# Altium schematic sheet 12_fit_YC.SchDoc
size A2
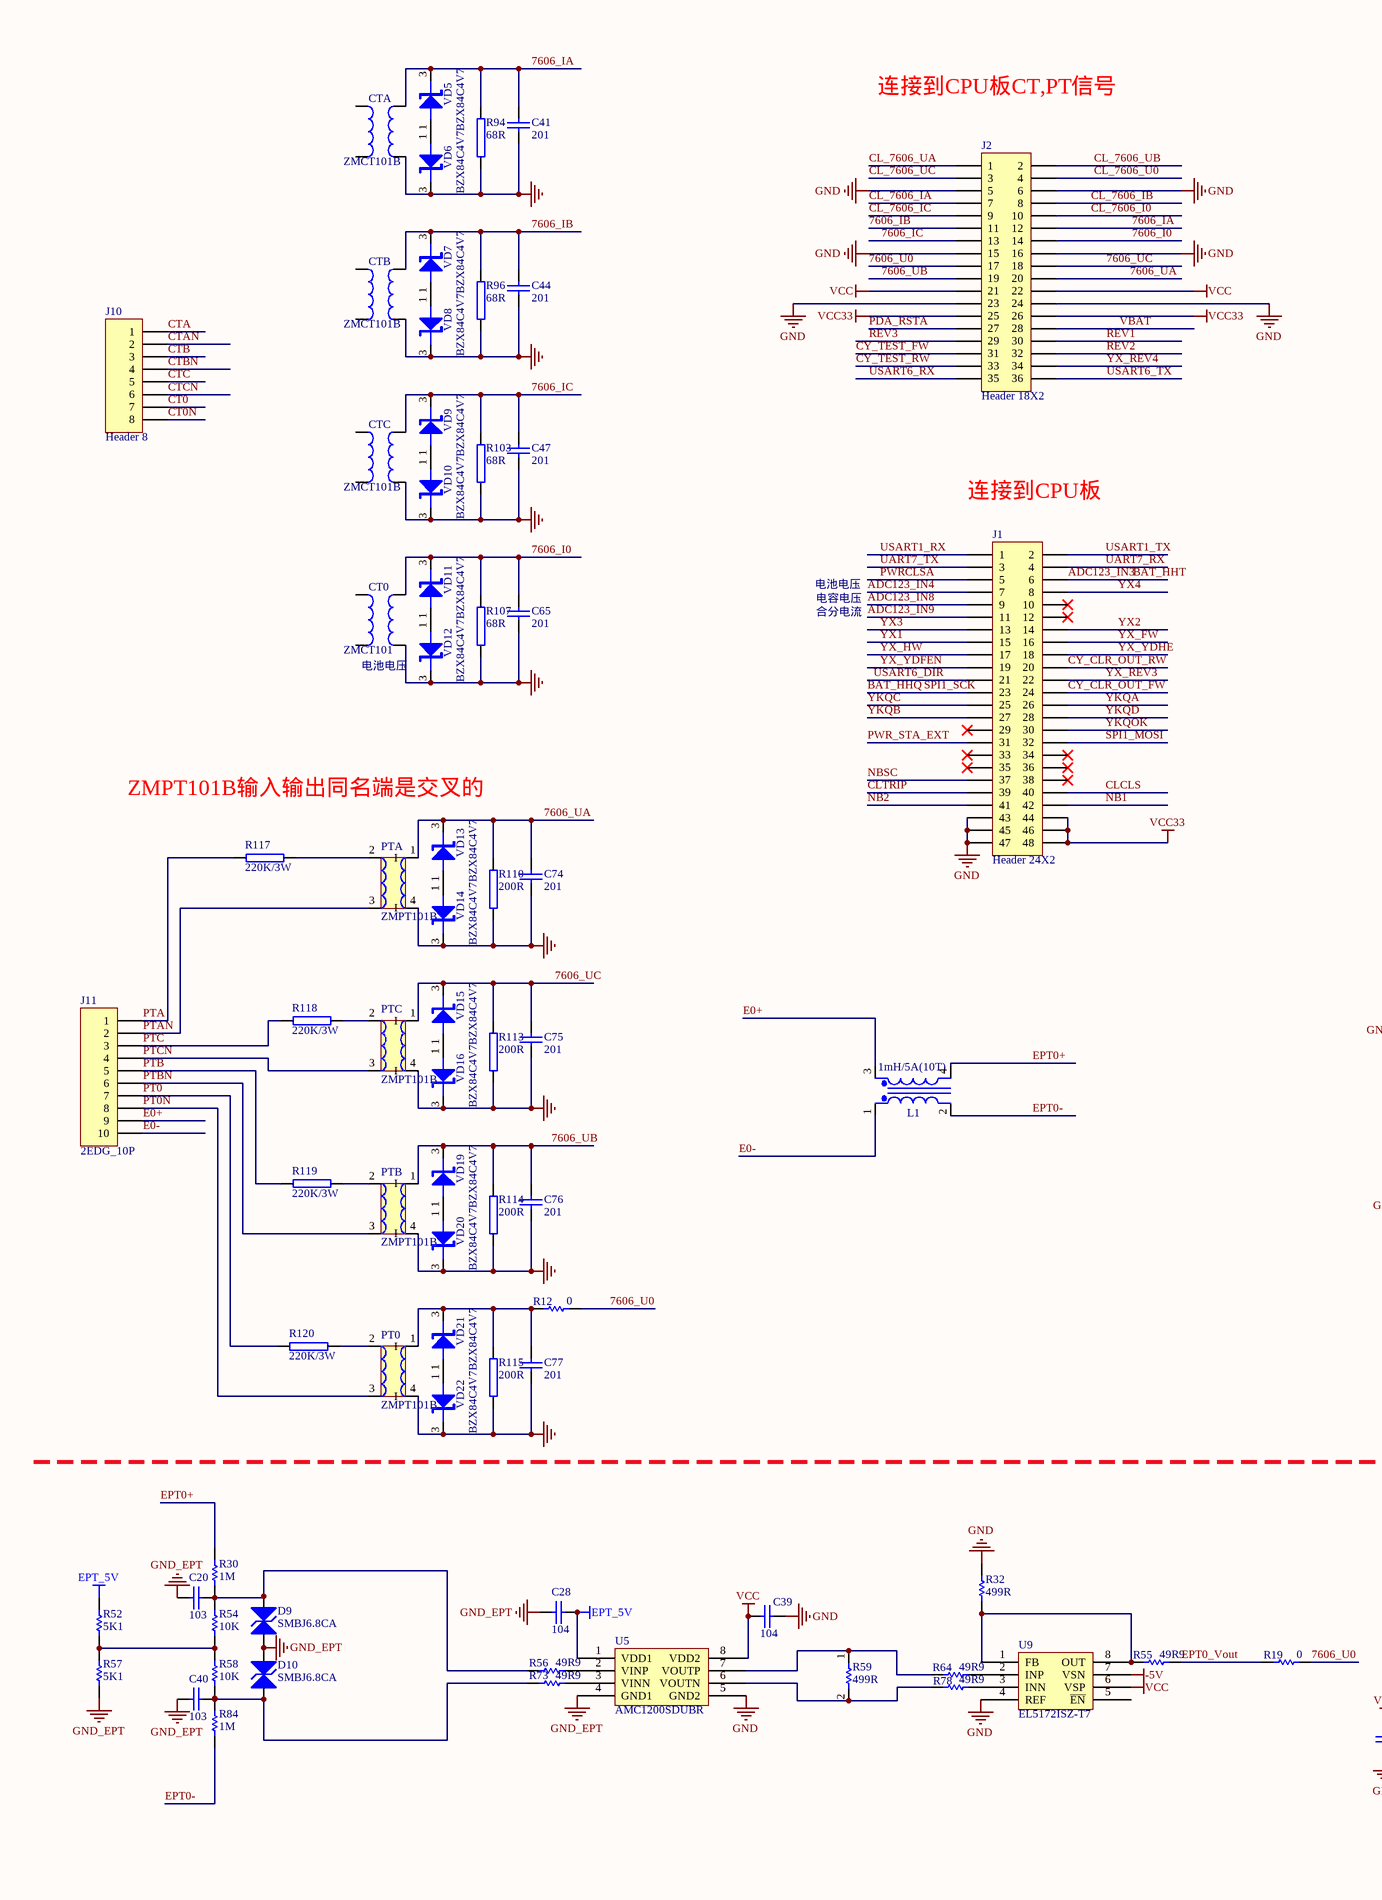
[diagram p0: 12_fit_YC.SchDoc, left]
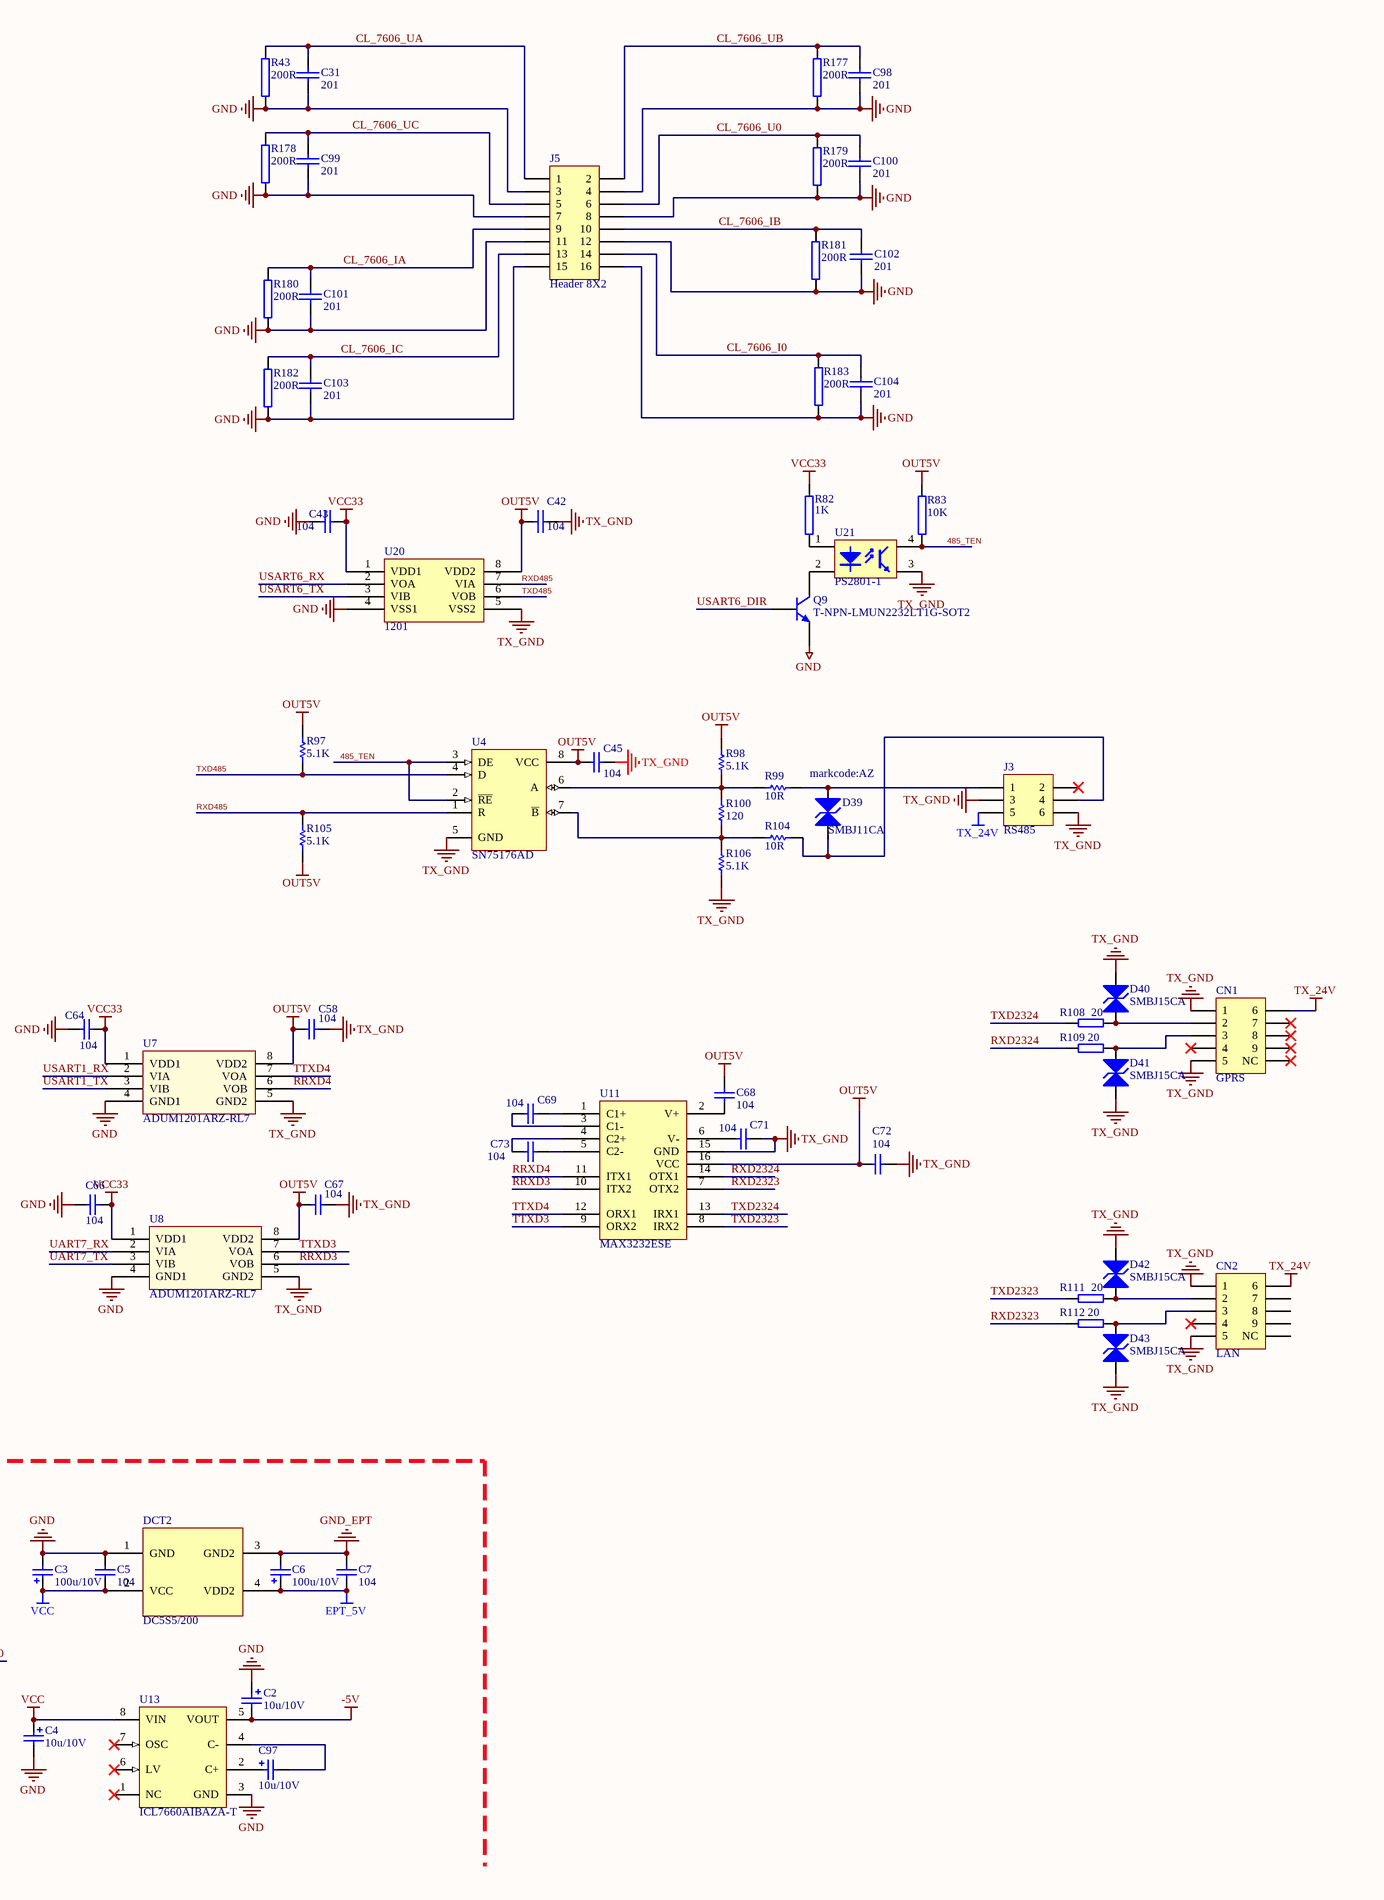
[diagram p1: 12_fit_YC.SchDoc, right]

## Parts
C2  10u/10V  [钽电容B型3528]
C3  100u/10V  [钽电容B型3528]
C4  10u/10V  [钽电容B型3528]
C5  104  [C1206]
C6  100u/10V  [钽电容B型3528]
C7  104  [C1206]
C20  103  [C1206]
C28  104  [C1206]
C31  201  [C1206]
C39  104  [C1206]
C40  103  [C1206]
C41  201  [C1206]
C42  104  [C1206]
C43  104  [C1206]
C44  201  [C1206]
C45  104  [C1206]
C47  201  [C1206]
C58  104  [C1206]
C64  104  [C1206]
C65  201  [C1206]
C66  104  [C1206]
C67  104  [C1206]
C68  104  [C1206]
C69  104  [C1206]
C71  104  [C1206]
C72  104  [C1206]
C73  104  [C1206]
C74  201  [C1206]
C75  201  [C1206]
C76  201  [C1206]
C77  201  [C1206]
C97  10u/10V  [钽电容B型3528]
C98  201  [C1206]
C99  201  [C1206]
C100  201  [C1206]
C101  201  [C1206]
C102  201  [C1206]
C103  201  [C1206]
C104  201  [C1206]
CN1  GPRS  [IDC10]
CN2  LAN  [IDC10]
CT0  ZMCT101  [ZMCT101B_OUTLINE]
CTA  ZMCT101B  [ZMCT101B_OUTLINE]
CTB  ZMCT101B  [ZMCT101B_OUTLINE]
CTC  ZMCT101B  [ZMCT101B_OUTLINE]
D9  SMBJ6.8CA  [SMT-5822]
D10  SMBJ6.8CA  [SMT-5822]
D39  SMBJ11CA  [SMT-5822]
D40  SMBJ15CA  [SMT-5822]
D41  SMBJ15CA  [SMT-5822]
D42  SMBJ15CA  [SMT-5822]
D43  SMBJ15CA  [SMT-5822]
DCT2  DC5S5/200  [IB-LS]
J1  Header 24X2  [HDR2X24]
J2  Header 18X2  [HDR2X18]
J3  RS485  [5569_3X2_4.2直]
J5  Header 8X2  [双排针母座2.54_2*8]
J10  Header 8  [XR_POWER9.5_8]
J11  2EDG_10P  [XR_POWER5.08_10_弯]
L1  1mH/5A(10T)  [EMI_22_3mH]
PT0  ZMPT101B  [ZMPT107]
PTA  ZMPT101B  [PT_SPT204A_2/2mA]
PTB  ZMPT101B  [ZMPT107]
PTC  ZMPT101B  [PT_SPT204A_2/2mA]
Q9  T-NPN-LMUN2232LT1G-SOT2  [SOT-23]
R12  0  [R1206]
R19  0  [R1206]
R30  1M  [R1206]
R32  499R  [R1206]
R43  200R  [R1206]
R52  5K1  [R1206]
R54  10K  [R1206]
R55  49R9  [R1206]
R56  49R9  [R1206]
R57  5K1  [R1206]
R58  10K  [R1206]
R59  499R  [R1206]
R64  49R9  [R1206]
R73  49R9  [R1206]
R78  49R9  [R1206]
R82  1K  [R1206]
R83  10K  [R1206]
R84  1M  [R1206]
R94  68R  [R1206]
R96  68R  [R1206]
R97  5.1K  [R1206]
R98  5.1K  [R1206]
R99  10R  [R1206]
R100  120  [R1206]
R103  68R  [R1206]
R104  10R  [R1206]
R105  5.1K  [R1206]
R106  5.1K  [R1206]
R107  68R  [R1206]
R108  20  [R1206]
R109  20  [R1206]
R110  200R  [R1206]
R111  20  [R1206]
R112  20  [R1206]
R113  200R  [R1206]
R114  200R  [R1206]
R115  200R  [R1206]
R117  220K/3W  [res-l5]
R118  220K/3W  [res-l5]
R119  220K/3W  [res-l5]
R120  220K/3W  [res-l5]
R177  200R  [R1206]
R178  200R  [R1206]
R179  200R  [R1206]
R180  200R  [R1206]
R181  200R  [R1206]
R182  200R  [R1206]
R183  200R  [R1206]
U4  SN75176AD  [SO8]
U5  AMC1200SDUBR  [SOP8(贴片DIP8)]
U7  ADUM1201ARZ-RL7  [SO8]
U8  ADUM1201ARZ-RL7  [SO8]
U9  EL5172ISZ-T7  [SO8]
U11  MAX3232ESE  [SOP16]
U13  ICL7660AIBAZA-T  [SO8]
U20  1201  [SO8]
U21  PS2801-1  [SO-4]
VD5  BZX84C4V7  [SOT-23]
VD6  BZX84C4V7  [SOT-23]
VD7  BZX84C4V7  [SOT-23]
VD8  BZX84C4V7  [SOT-23]
VD9  BZX84C4V7  [SOT-23]
VD10  BZX84C4V7  [SOT-23]
VD11  BZX84C4V7  [SOT-23]
VD12  BZX84C4V7  [SOT-23]
VD13  BZX84C4V7  [SOT-23]
VD14  BZX84C4V7  [SOT-23]
VD15  BZX84C4V7  [SOT-23]
VD16  BZX84C4V7  [SOT-23]
VD19  BZX84C4V7  [SOT-23]
VD20  BZX84C4V7  [SOT-23]
VD21  BZX84C4V7  [SOT-23]
VD22  BZX84C4V7  [SOT-23]

## Nets
-5V: C2.2 U9.7(VSN) U13.5(VOUT)
EPT_5V: C6.1 C7.2 C28.1 DCT2.4(VDD2) R52.1 U5.1(VDD1)
GND: C2.1 C3.2 C4.2 C5.1 C31.2 C39.1 C41.2 C43.1 C44.2 C47.2 C64.1 C65.2 C66.1 C74.2 C75.2 C76.2 C77.2 C98.2 C99.2 C100.2 C101.2 C102.2 C103.2 C104.2 CT0.2 CTA.2 CTB.2 CTC.2 DCT2.1(GND) J1.43 J1.45 J1.47 J2.5 J2.6 J2.15 J2.16 J2.23 J2.24 J5.3 J5.4 J5.7 J5.8 J5.11 J5.12 J5.15 J5.16 PT0.4(I) PTA.4(I) PTB.4(I) PTC.4(I) Q9.2(E) R32.1 R43.1 R94.1 R96.1 R103.1 R107.1 R110.1 R113.1 R114.1 R115.1 R177.1 R178.1 R179.1 R180.1 R181.1 R182.1 R183.1 U5.5(GND2) U7.4(GND1) U8.4(GND1) U9.4(REF) U13.3(GND) U20.4(VSS1) VD6.3(K) VD8.3(K) VD10.3(K) VD12.3(K) VD14.3(K) VD16.3(K) VD20.3(K) VD22.3(K)
GND_EPT: C6.2 C7.1 C20.2 C28.2 C40.2 D9.1(A) D10.1(A) DCT2.3(GND2) R57.2 U5.4(GND1)
OUT5V: C42.2 C45.2 C58.2 C67.2 C68.1 C72.2 R83.2 R97.1 R98.2 R105.1 U4.8(VCC) U7.8(VDD2) U8.8(VDD2) U11.16(VCC) U20.8(VDD2)
TX_24V: CN1.2(6) CN2.2(6) J3.5
TX_GND: C42.1 C45.1 C58.1 C67.1 C71.1 C72.1 CN1.1 CN1.9(5) CN2.1 CN2.9(5) D40.1(A) D41.1(A) D42.1(A) D43.1(A) J3.3 J3.6 R106.1 U4.5(GND) U7.5(GND2) U8.5(GND2) U11.15(GND) U20.5(VSS2) U21.3
VCC: C3.1 C4.1 C5.2 C39.2 DCT2.2(VCC) J2.21 J2.22 U5.8(VDD2) U9.6(VSP) U13.8(VIN)
VCC33: C43.2 C64.2 C66.2 J1.44 J1.46 J1.48 J2.25 J2.26 R82.2 U7.1(VDD1) U8.1(VDD1) U20.1(VDD1)
485_TEN: R83.1 U4.2(~{RE}) U4.3(DE) U21.4
7606_I0: C65.1 CT0.4 J2.14 R107.2 VD11.3(K)
7606_IA: C41.1 CTA.4 J2.12 R94.2 VD5.3(K)
7606_IB: C44.1 CTB.4 J2.11 R96.2 VD7.3(K)
7606_IC: C47.1 CTC.4 J2.13 R103.2 VD9.3(K)
7606_U0: J2.17 R12.2 R19.2
7606_UA: C74.1 J2.20 PTA.1(I) R110.2 VD13.3(K)
7606_UB: C76.1 J2.19 PTB.1(I) R114.2 VD19.3(K)
7606_UC: C75.1 J2.18 PTC.1(I) R113.2 VD15.3(K)
ADC123_IN3: J1.6  [also labelled BAT_HHT]
ADC123_IN4: J1.7
ADC123_IN8: J1.9
ADC123_IN9: J1.11
BAT_HHQ: J1.23  [also labelled SPI1_SCK]
CL_7606_I0: C104.1 J2.10 J5.14 R183.2
CL_7606_IA: C101.1 J2.7 J5.9 R180.2
CL_7606_IB: C102.1 J2.8 J5.10 R181.2
CL_7606_IC: C103.1 J2.9 J5.13 R182.2
CL_7606_U0: C100.1 J2.4 J5.6 R179.2
CL_7606_UA: C31.1 J2.1 J5.1 R43.2
CL_7606_UB: C98.1 J2.2 J5.2 R177.2
CL_7606_UC: C99.1 J2.3 J5.5 R178.2
CLCLS: J1.40
CLTRIP: J1.39
CT0: J10.7
CT0N: J10.8
CTA: J10.1
CTAN: J10.2
CTB: J10.3
CTBN: J10.4
CTC: J10.5
CTCN: J10.6
CY_CLR_OUT_FW: J1.24
CY_CLR_OUT_RW: J1.20
CY_TEST_FW: J2.31
CY_TEST_RW: J2.33
E0+: J11.9 L1.3(Sec+)
E0-: J11.10 L1.1(Pri+)
EPT0+: L1.4(Sec-) R30.2
EPT0-: L1.2(Pri-) R84.2
EPT0_Vout: R19.1 R55.2
NB1: J1.42
NB2: J1.41
NBSC: J1.37
PDA_RSTA: J2.27
PT0: J11.7 R120.1
PT0N: J11.8 PT0.3
PTA: J11.1 R117.1
PTAN: J11.2 PTA.3
PTB: J11.5 R119.1
PTBN: J11.6 PTB.3
PTC: J11.3 R118.1
PTCN: J11.4 PTC.3
PWR_STA_EXT: J1.31
PWRCLSA: J1.5
REV1: J2.30
REV2: J2.32
REV3: J2.29
RRXD3: U8.6(VOB) U11.10(ITX2)
RRXD4: U7.6(VOB) U11.11(ITX1)
RXD485: R105.2 U4.1(R) U20.7(VIA)
RXD2323: R112.1 U11.7(OTX2)
RXD2324: R109.1 U11.14(OTX1)
SPI1_MOSI: J1.32
TTXD3: U8.7(VOA) U11.9(ORX2)
TTXD4: U7.7(VOA) U11.12(ORX1)
TXD485: R97.2 U4.4(D) U20.6(VOB)
TXD2323: R111.1 U11.8(IRX2)
TXD2324: R108.1 U11.13(IRX1)
UART7_RX: J1.4 U8.2(VIA)
UART7_TX: J1.3 U8.3(VIB)
USART1_RX: J1.1 U7.2(VIA)
USART1_TX: J1.2 U7.3(VIB)
USART6_DIR: J1.21 Q9.1(B)
USART6_RX: J2.35 U20.2(VOA)
USART6_TX: J2.36 U20.3(VIB)
VBAT: J2.28
YKQA: J1.26
YKQB: J1.27
YKQC: J1.25
YKQD: J1.28
YKQOK: J1.30
YX1: J1.15
YX2: J1.14
YX3: J1.13
YX4: J1.8
YX_FW: J1.16
YX_HW: J1.17
YX_REV3: J1.22
YX_REV4: J2.34
YX_YDFEN: J1.19
YX_YDHE: J1.18
NetC20_1: C20.1 D9.2(K) R30.1 R54.2 R56.1
NetC40_1: C40.1 D10.2(K) R58.2 R73.1 R84.1
NetC68_2: C68.2 U11.2(V+)
NetC69_1: C69.1 U11.1(C1+)
NetC69_2: C69.2 U11.3(C1-)
NetC71_2: C71.2 U11.6(V-)
NetC73_1: C73.1 U11.5(C2-)
NetC73_2: C73.2 U11.4(C2+)
NetC77_1: C77.1 PT0.1(I) R12.1 R115.2 VD21.3(K)
NetC97_1: C97.1 U13.2(C+)
NetC97_2: C97.2 U13.4(C-)
NetCN1_3: CN1.3(2) D40.2(K) R108.2
NetCN1_5: CN1.5(3) D41.2(K) R109.2
NetCN2_3: CN2.3(2) D42.2(K) R111.2
NetCN2_5: CN2.5(3) D43.2(K) R112.2
NetD39_1: D39.1(A) J3.4 R104.1
NetD39_2: D39.2(K) J3.1 R99.1
NetPT0_2: PT0.2(O) R120.2
NetPTA_2: PTA.2(O) R117.2
NetPTB_2: PTB.2(O) R119.2
NetPTC_2: PTC.2(O) R118.2
NetQ9_3: Q9.3(C) U21.2
NetR32_2: R32.2 R55.1 U9.1(FB) U9.8(OUT)
NetR52_2: R52.2 R54.1 R57.1 R58.1
NetR56_2: R56.2 U5.2(VINP)
NetR59_1: R59.1 R64.1 U5.7(VOUTP)
NetR59_2: R59.2 R78.1 U5.6(VOUTN)
NetR64_2: R64.2 U9.2(INP)
NetR73_2: R73.2 U5.3(VINN)
NetR78_2: R78.2 U9.3(INN)
NetR82_1: R82.1 U21.1
NetR98_1: R98.1 R99.2 R100.2 U4.6(A)
NetR100_1: R100.1 R104.2 R106.2 U4.7(~{B})
NetVD5_1: VD5.1(A) VD6.1(A)
NetVD7_1: VD7.1(A) VD8.1(A)
NetVD9_1: VD9.1(A) VD10.1(A)
NetVD11_1: VD11.1(A) VD12.1(A)
NetVD13_1: VD13.1(A) VD14.1(A)
NetVD15_1: VD15.1(A) VD16.1(A)
NetVD19_1: VD19.1(A) VD20.1(A)
NetVD21_1: VD21.1(A) VD22.1(A)

Not connected (* = marked no-connect by the designer): CN1 4(7)* 6(8)* 7(4)* 8(9)* 10(NC)*; CN2 4(7) 6(8) 7(4)* 8(9) 10(NC); CT0 1 3; CTA 1 3; CTB 1 3; CTC 1 3; J1 10* 12* 29* 33* 34* 35* 36* 38*; J3 2*; U9 5(~{EN}); U13 1(NC)* 6(LV)* 7(OSC)*

## Notes on the sheet
- 连接到CPU板CT,PT信号
- 连接到CPU板
- 电池电压
- 电容电压
- 合分电流
- (near CT0) 电池电压
- ZMPT101B输入输出同名端是交叉的
- markcode:AZ

## Library data of the parts
C2-C4 C6 C97 = Cap Pol2: Polarized Capacitor (Axial); Value: 100pF; Published: 8-Jun-2000; LatestRevisionDate: 17-Jul-2002; LatestRevisionNote: Re-released for DXP Platform.; PackageReference: POLAR0.8; Publisher: Altium Limited; PackageDescription: Polarized Capacitor; 2 Leads
C5 C7 C45 C58 C64 C66-C69 C71-C73 = Cap: Capacitor; Value: 100pF; Published: 8-Jun-2000; LatestRevisionDate: 17-Jul-2002; LatestRevisionNote: Re-released for DXP Platform.; PackageReference: RAD-0.3; Publisher: Altium Limited; PackageDescription: Radial Cap, Thru-Hole; 2 Leads; 0.3 in Pin Spacing
C20 C28 C31 C39-C44 C47 C65 C74-C77 C98-C104 = CAP: Capacitor
CN1 CN2 = Header 5X2: Header, 5-Pin, Dual row; LatestRevisionDate: 17-Jul-2002; LatestRevisionNote: Re-released for DXP Platform.; Publisher: Altium Limited
CT0 CTA CTB CTC = TRANS3
D9 D10 D39-D43 = TVS: Published: 8-Jun-2000; LatestRevisionDate: 17-Jul-2002; LatestRevisionNote: Re-released for DXP Platform.; PackageReference: DIODE-0.7; Publisher: Altium Limited; PackageDescription: Diode, Thru-Hole; 2 Leads; 0.7 in Pin Spacing
DCT2 = 05S05-N1/N2
J1 = Header 24X2: Header, 24-Pin, Dual row; LatestRevisionDate: 17-Jul-2002; LatestRevisionNote: Re-released for DXP Platform.; Publisher: Altium Limited
J2 = Header 18X2: Header, 18-Pin, Dual row; LatestRevisionDate: 17-Jul-2002; LatestRevisionNote: Re-released for DXP Platform.; Publisher: Altium Limited
J3 = Header 3X2: Header, 3-Pin, Dual row; LatestRevisionDate: 17-Jul-2002; LatestRevisionNote: Re-released for DXP Platform.; Publisher: Altium Limited
J5 = Header 8X2: Header, 8-Pin, Dual row; LatestRevisionDate: 17-Jul-2002; LatestRevisionNote: Re-released for DXP Platform.; Publisher: Altium Limited
J10 = Header 8: Header, 8-Pin; LatestRevisionDate: 17-Jul-2002; LatestRevisionNote: Re-released for DXP Platform.; Publisher: Altium Limited
J11 = Header 10: Header, 10-Pin; LatestRevisionDate: 17-Jul-2002; LatestRevisionNote: Re-released for DXP Platform.; Publisher: Altium Limited
L1 = Trans Cupl: Transformer (Coupled Inductor Model); Published: 8-Jun-2000; LatestRevisionDate: 17-Jul-2002; LatestRevisionNote: Re-released for DXP Platform.; PackageReference: TRF_4; Publisher: Altium Limited; PackageDescription: Transformer; 4 Leads
PT0 PTA PTB PTC = V-SENOR
Q9 = SOT-23 2SC3356-T1B-A    S/YS档: 三极管; ComponentLink1Description: 供应商链接; ComponentLink1URL: http://www.szlcsc.com/product/details_10189.html; Package: SOT-23; Supplier: LC; SuppliersPartNumber: C9659
R12 R19 R30 R32 R52 R55-R57 R59 R64 R73 R78 R84 R97-R100 R104-R106 = Res1: Resistor; Value: 10K; Published: 8-Jun-2000; LatestRevisionDate: 17-Jul-2002; LatestRevisionNote: Re-released for DXP Platform.; PackageReference: AXIAL-0.3; Publisher: Altium Limited; PackageDescription: Axial Device, Thru-Hole; 2 Leads; 0.3 in Pin Spacing
R43 R82 R83 R94 R96 R103 R107 R110 R113-R115 R117-R120 R177-R183 = RES2
R54 R58 = Res1: Resistor; Published: 8-Jun-2000; LatestRevisionDate: 17-Jul-2002; LatestRevisionNote: Re-released for DXP Platform.; PackageReference: AXIAL-0.3; Publisher: Altium Limited; PackageDescription: Axial Device, Thru-Hole; 2 Leads; 0.3 in Pin Spacing; Value: 10K
R108 R109 R111 R112 = RES
U4 = SN75176AD: Differential Bus Transceiver; Note: Receiver Hysteresis of 50mV Typical; Published: 15-May-2002; LatestRevisionDate: 13-Apr-2006; LatestRevisionNote: IPC-7351 Footprint Added.; DatasheetVersion: Aug-1989; PackageVersion: Jan-1998; PackageReference: D008; Publisher: Altium Limited; PackageDescription: 8-Pin Small Outline Integrated Circuit 1.27 mm Pitch; Code_IPC: SOIC127P600-8; ComponentLink1Description: Manufacturer Link; ComponentLink1URL: http://www.ti.com/; ComponentLink2Description: Datasheet; ComponentLink2URL: http://www-s.ti.com/sc/ds/sn75176a.pdf
U5 = AMC1200SDUBR: single power isolator amp fixed gain is 8
U7 U8 = ADUM1201ARZ-RL7: 隔离器; ComponentLink1Description: 供应商链接; ComponentLink1URL: http://www.szlcsc.com/product/details_10199.html; Package: SOIC-8_150mil; Supplier: LC; SuppliersPartNumber: C9669
U11 = MAX202
U13 = TC7660EOA: Charge Pump DC-to-DC Voltage Converter, 8-Pin SOIC 150mil, Industrial Temperature; Published: 29-Jan-2009; DatasheetVersion: revB, Nov-2002; PackageVersion: revAW, Oct-2008; PackageReference: SOIC-OA8; Publisher: Altium Limited; PackageDescription: 8-Lead Plastic Small Outline (OA) - Narrow, 3.90mm Body [SOIC]; Code_IPC: SOIC127P600-8; ComponentLink1Description: Manufacturer Link; ComponentLink1URL: http://www.microchip.com; ComponentLink2Description: Datasheet; ComponentLink2URL: http://ww1.microchip.com/downloads/en/DeviceDoc/21465b.pdf; ComponentLink3Description: Packaging Specification; ComponentLink3URL: http://ww1.microchip.com/downloads/en/PackagingSpec/00049AW.pdf
U20 = COMPONENT_3
U21 = TLP521
VD5-VD16 VD19-VD22 = ZENER2